# Altium project Task-3.PrjPcb
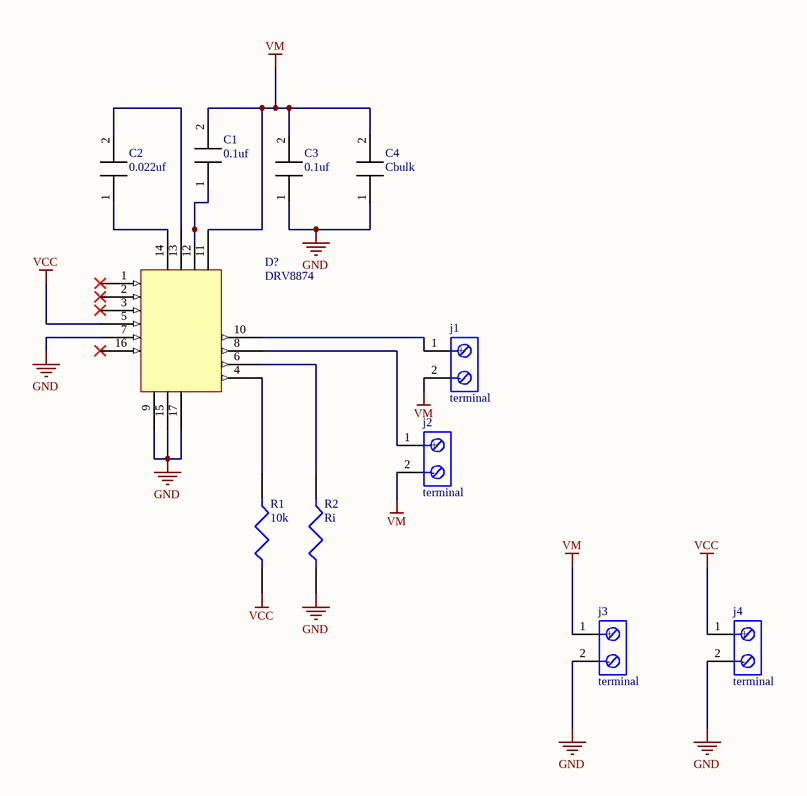
[diagram p0: Sheet2.SchDoc]
1 sheet, 11 parts. Net scope: global (net labels, ports and power ports of the same name join across sheets).
Board file: PCB1.PcbDoc

## Sheet Sheet2.SchDoc
size A4; SheetNumber: 1; SheetTotal: 1

### Parts
C1  0.1uf  [Capacitor]
C2  0.022uf  [Capacitor]
C3  0.1uf  [Capacitor]
C4  Cbulk  [Capacitor]
D1  DRV8874  [LCC16]
j1  terminal  [TERMINAL - duplicate]
j2  terminal  [TERMINAL - duplicate]
j3  terminal  [TERMINAL - duplicate]
j4  terminal  [TERMINAL - duplicate]
R1  10k  [Resistor]
R2  Ri  [Resistor]

### Nets
GND: C3.1 C4.1 D1.7 D1.9 D1.15 D1.17 j3.2(-) j4.2(-) R2.1
VCC: D1.5 j4.1(+) R1.1
VM: C1.2 C3.2 C4.2 D1.11 j1.2(-) j2.2(-) j3.1(+)
NetC1_1: C1.1 D1.12
NetC2_1: C2.1 D1.14
NetC2_2: C2.2 D1.13
NetD1_4: D1.4 R1.2
NetD1_6: D1.6 R2.2
NetD1_8: D1.8 j2.1(+)
NetD1_10: D1.10 j1.1(+)

Not connected (* = marked no-connect by the designer): D1 1* 2* 3* 16*

### Library data of the parts
C1-C4 = capacitor: Aluminum Electrolytic Capacitor, Aluminum (wet); Manufacturer: Wurth Electronics; Manufacturer Part Number: 860020672005; Dielectric Material: Aluminium; Supplier: Digikey; Supplier Part Number: 732-8851-1-ND; RoHS: Yes; Category: Aluminum Electrolytic Capacitors; Stock: 10459; Pricing: 1=0.1, 50=0.089, 100=0.078, 250=0.069, 500=0.06, 1000=0.058 (USD); Pins: 2; Capacitor Type: Aluminium; Reach SVHC Compliant: Yes; RoHS Compliant: Yes; ComponentLink1URL: https://datasheet.ciiva.com:443/pdfs/VipMasterIC/IC/MIDC/MIDC-S-A0000764616/MIDC-S-A0000764162-1.pdf?src-supplier=IHS+Markit; ComponentLink1Description: https://datasheet.ciiva.com:443/pdfs/VipMasterIC/IC/MIDC/MIDC-S-A0000764616/MIDC-S-A0000764162-1.pdf?src-supplier=IHS+Markit; ComponentLink2URL: http://www.farnell.com/datasheets/1879647.pdf?src-supplier=Farnell; ComponentLink2Description: http://www.farnell.com/datasheets/1879647.pdf?src-supplier=Farnell; ComponentLink3URL: http://katalog.we-online.de/pbs/datasheet/860020672005.pdf?src-supplier=Digikey; ComponentLink3Description: http://katalog.we-online.de/pbs/datasheet/860020672005.pdf?src-supplier=Digikey; ComponentLink4URL: https://katalog.we-online.de/pbs/datasheet/860020672005.pdf?src-supplier=Digikey; ComponentLink4Description: https://katalog.we-online.de/pbs/datasheet/860020672005.pdf?src-supplier=Digikey; ComponentLink5URL: http://www.farnell.com/datasheets/1879647.pdf?src-supplier=Element14; ComponentLink5Description: http://www.farnell.com/datasheets/1879647.pdf?src-supplier=Element14
j1-j4 = terminal_1: Barrier Strip Terminal Block; Manufacturer: Wurth Electronics; Manufacturer Part Number: 691137710002; Supplier: Rs; Supplier Part Number: 1769908; RoHS: No; Category: Terminal Blocks; Stock: 355; Pricing: 500=0.218, 1000=0.202, 2500=0.189 (GBP); RoHS Compliant: Yes; ComponentLink1URL: https://datasheet.ciiva.com:443/pdfs/VipMasterIC/IC/MIDC/MIDC-S-A0005074262/MIDC-S-A0004711666-1.pdf?src-supplier=IHS+Markit; ComponentLink1Description: https://datasheet.ciiva.com:443/pdfs/VipMasterIC/IC/MIDC/MIDC-S-A0005074262/MIDC-S-A0004711666-1.pdf?src-supplier=IHS+Markit; ComponentLink2URL: https://katalog.we-online.de/em/datasheet/691137710002.pdf?src-supplier=Digikey; ComponentLink2Description: https://katalog.we-online.de/em/datasheet/691137710002.pdf?src-supplier=Digikey
R1 R2 = Resistor: RES SMD 230OHM 0.01% 1/4W J LEAD; Part Number: Y1121230R000T9L-ND; ComponentLink1Description: DigiKey; ComponentLink1URL: https://www.digikey.com/en/products/detail/vpg-foil-resistors/Y1121230R000T9L/4225988
D? = DRV8874: ComponentLink1Description: DigiKey; ComponentLink1URL: https://www.digikey.com/en/products/detail/texas-instruments/DRV8874PWPR/11502339